# EAGLE schematic Relay_Driver_Board_Tutorial (EAGLE 8.1.1)
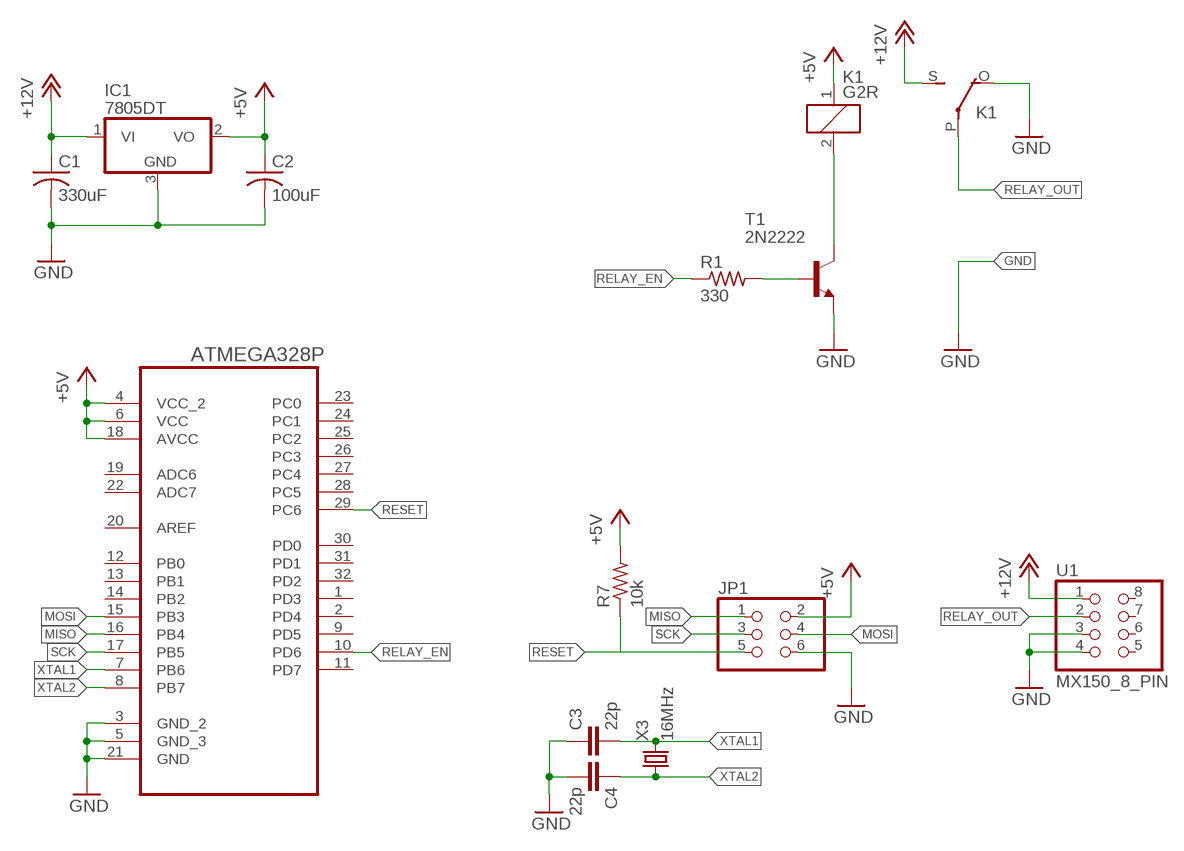
[diagram p0: schematic, sheet 1]

## Parts
ATMEGA328P  ATMEGA328P-AU  [QFP80P900X900X120-32N]
C1  330uF  C-USC0805  [C0805]
C2  100uF  C-USC0805  [C0805]
C3  22p  C-EUC0805K  [C0805K]
C4  22p  C-EUC0805K  [C0805K]
IC1  7805DT  [TO252]
JP1  PINHD-2X3  [2X03]
K1  G2R  [G2R]
R1  330  R-US_R0805  [R0805]
R7  10k  R-US_R0805  [R0805]
T1  2N2222  2N3904  [TO92]
U1  MX150_8_PIN  [MX150_8]
X3  16MHz  CRYSTAL  [QS]

## Nets
+5V: ATMEGA328P.4(VCC_2) ATMEGA328P.6(VCC) ATMEGA328P.18(AVCC) C2.1 IC1.2(VO) JP1.2 K1.1 R7.2
+12V: C1.1 IC1.1(VI) K1.S(2:S) U1.1
GND: ATMEGA328P.3(GND_2) ATMEGA328P.5(GND_3) ATMEGA328P.21(GND) C1.2 C2.2 C3.1 C4.2 IC1.3(GND) JP1.6 K1.O(2:O) T1.3(E) U1.3 U1.4
MISO: ATMEGA328P.16(PB4) JP1.1
MOSI: ATMEGA328P.15(PB3) JP1.4
N$1: R1.2 T1.2(B)
N$3: K1.2 T1.1(C)
RELAY_EN: ATMEGA328P.10(PD6) R1.1
RELAY_OUT: K1.P(2:P) U1.2
RESET: ATMEGA328P.29(PC6) JP1.5 R7.1
SCK: ATMEGA328P.17(PB5) JP1.3
XTAL1: ATMEGA328P.7(PB6) C3.2 X3.2
XTAL2: ATMEGA328P.8(PB7) C4.1 X3.1
Unconnected: ATMEGA328P.1(PD3) ATMEGA328P.2(PD4) ATMEGA328P.9(PD5) ATMEGA328P.11(PD7) ATMEGA328P.12(PB0) ATMEGA328P.13(PB1) ATMEGA328P.14(PB2) ATMEGA328P.19(ADC6) ATMEGA328P.20(AREF) ATMEGA328P.22(ADC7) ATMEGA328P.23(PC0) ATMEGA328P.24(PC1) ATMEGA328P.25(PC2) ATMEGA328P.26(PC3) ATMEGA328P.27(PC4) ATMEGA328P.28(PC5) ATMEGA328P.30(PD0) ATMEGA328P.31(PD1) ATMEGA328P.32(PD2) U1.5 U1.6 U1.7 U1.8

## Library data of the parts
ATMEGA328P = Atmel_By_element14_Batch_1-00:ATMEGA328P-AU: 8-bit Microcontroller with In-System Programmable Flash; MPN: ATMEGA328P-AU; OC_FARNELL: 1715486; OC_NEWARK: 14R4631; PACKAGE: TQFP-32; SUPPLIER: Atmel
C1 C2 = rcl:C-US: CAPACITOR, American symbol
C3 C4 = resistor:C-EU: CAPACITOR, European symbol
IC1 = linear:78*: Positive VOLTAGE REGULATOR Source: http://cache.national.com/ds/LM/LM78L05.pdf http://www.fairchildsemi.com/ds/LM/LM7805.pdf
JP1 = pinhead:PINHD-2X3: PIN HEADER
K1 = Relays:G2R: RELAY 1 x switch, Omron; OC_FARNELL: 1569185; OC_NEWARK: unknown
R1 R7 = rcl:R-US_: RESISTOR, American symbol
T1 = transistor-neu-to92:2N3904: NPN TRANSISTOR
U1 = Connectors:MX150_8_PIN
X3 = crystal:CRYSTAL